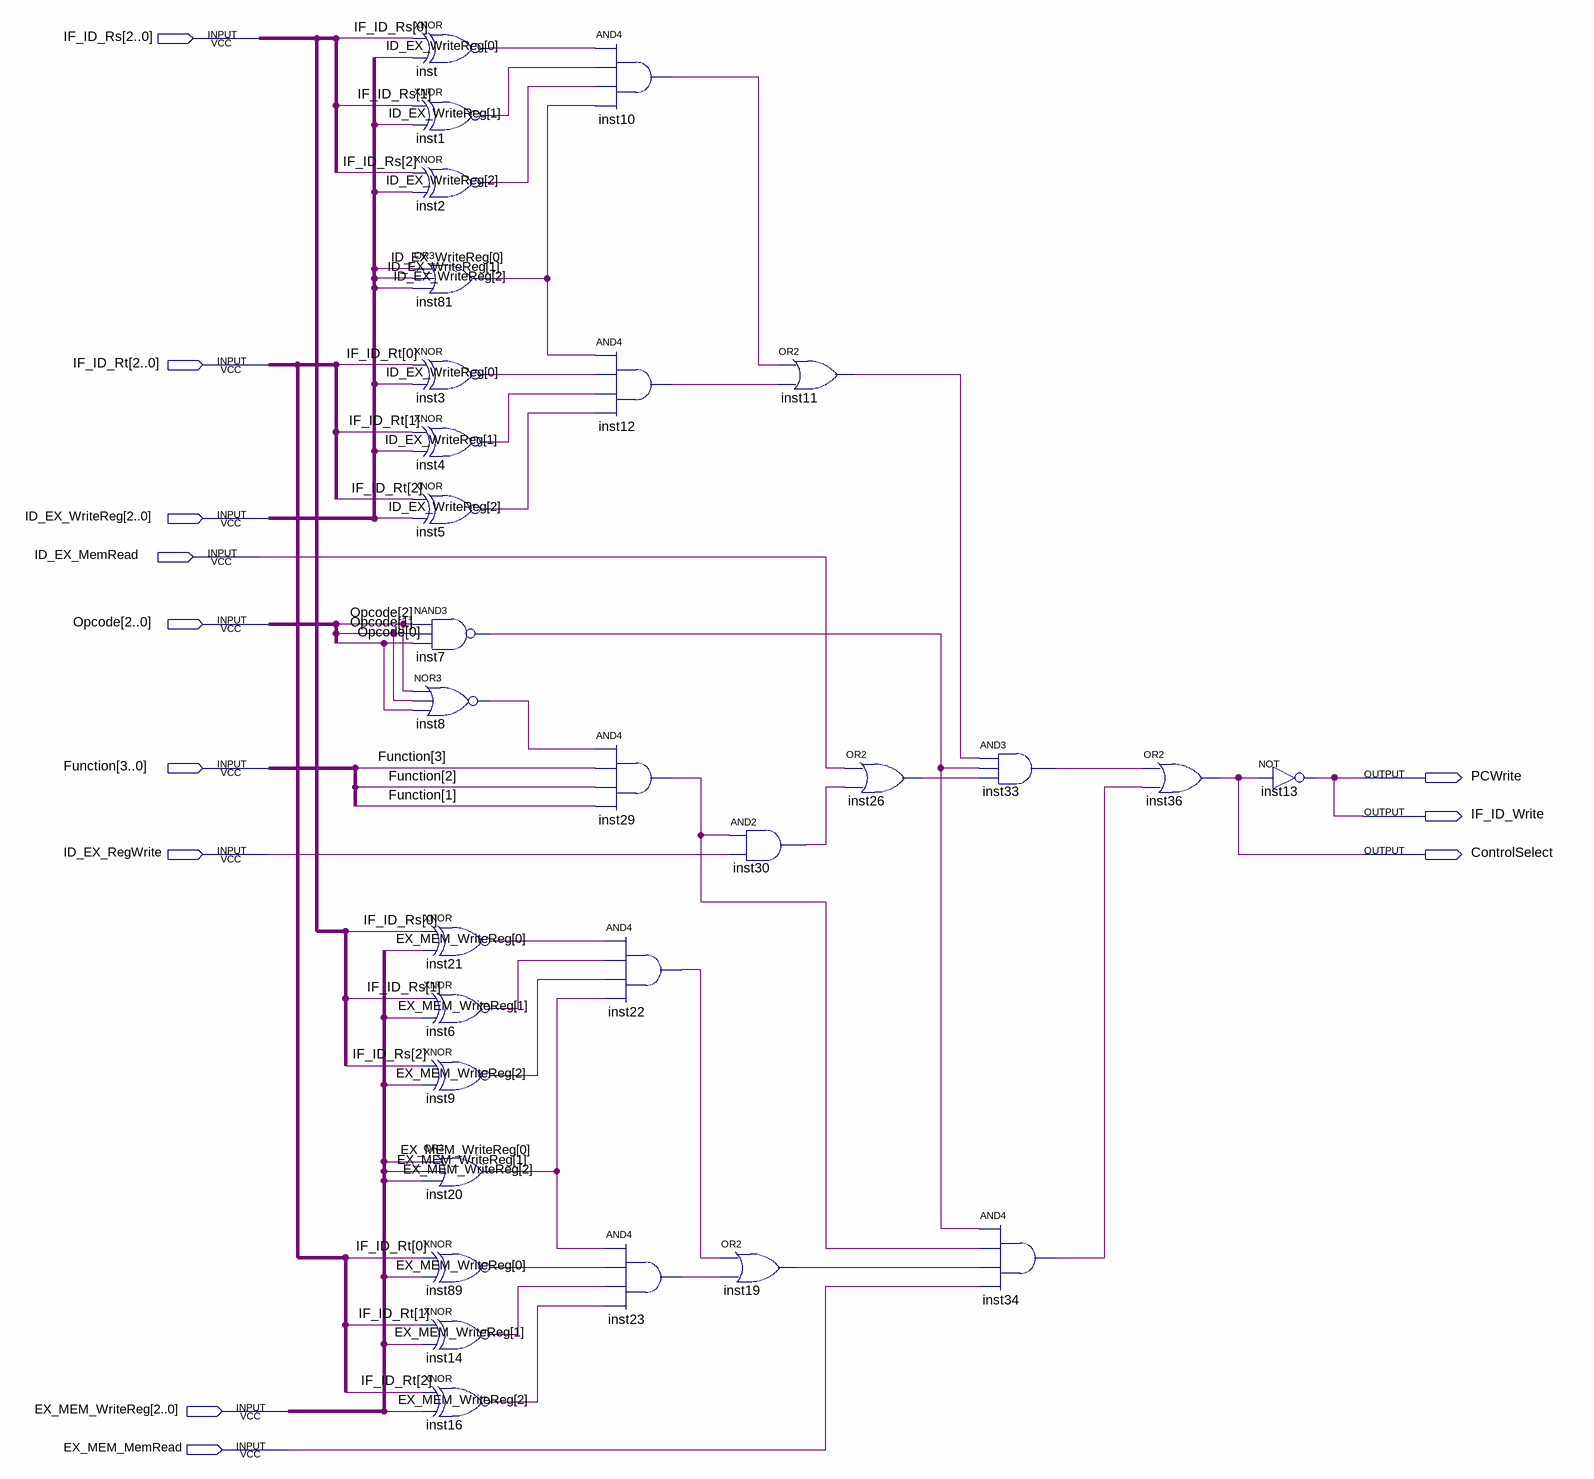
[diagram p0: schematic sheet]
// Quartus schematic HazardDetectionUnit.bdf as structural Verilog: 29 symbols, 12 pins
module HazardDetectionUnit (
  input  [2:0] IF_ID_Rs,
  input  [2:0] IF_ID_Rt,
  input  [2:0] ID_EX_WriteReg,
  input  ID_EX_MemRead,
  input  [2:0] Opcode,
  input  [3:0] Function,
  input  ID_EX_RegWrite,
  input  [2:0] EX_MEM_WriteReg,
  input  EX_MEM_MemRead,
  output PCWrite,
  output IF_ID_Write,
  output ControlSelect
);

  wire inst1_out, inst2_out, inst3_out, inst4_out, inst5_out, inst6_out, inst7_out, inst8_out, inst9_out,
       inst10_out, inst11_out, inst12_out, inst14_out, inst16_out, inst19_out, inst20_out, inst21_out,
       inst22_out, inst23_out, inst26_out, inst29_out, inst30_out, inst33_out, inst34_out, inst81_out,
       inst89_out, inst_out;

  xnor inst (inst_out, IF_ID_Rs[0], ID_EX_WriteReg[0]);
  xnor inst1 (inst1_out, IF_ID_Rs[1], ID_EX_WriteReg[1]);
  xnor inst2 (inst2_out, IF_ID_Rs[2], ID_EX_WriteReg[2]);
  or inst81 (inst81_out, ID_EX_WriteReg[0], ID_EX_WriteReg[1], ID_EX_WriteReg[2]);
  xnor inst3 (inst3_out, IF_ID_Rt[0], ID_EX_WriteReg[0]);
  xnor inst4 (inst4_out, IF_ID_Rt[1], ID_EX_WriteReg[1]);
  xnor inst5 (inst5_out, IF_ID_Rt[2], ID_EX_WriteReg[2]);
  nand inst7 (inst7_out, Opcode[2], Opcode[1], Opcode[0]);
  nor inst8 (inst8_out, Opcode[2], Opcode[1], Opcode[0]);
  xnor inst21 (inst21_out, IF_ID_Rs[0], EX_MEM_WriteReg[0]);
  xnor inst6 (inst6_out, IF_ID_Rs[1], EX_MEM_WriteReg[1]);
  xnor inst9 (inst9_out, IF_ID_Rs[2], EX_MEM_WriteReg[2]);
  or inst20 (inst20_out, EX_MEM_WriteReg[0], EX_MEM_WriteReg[1], EX_MEM_WriteReg[2]);
  xnor inst89 (inst89_out, IF_ID_Rt[0], EX_MEM_WriteReg[0]);
  xnor inst14 (inst14_out, IF_ID_Rt[1], EX_MEM_WriteReg[1]);
  xnor inst16 (inst16_out, IF_ID_Rt[2], EX_MEM_WriteReg[2]);
  and inst10 (inst10_out, inst_out, inst1_out, inst2_out, inst81_out);
  and inst12 (inst12_out, inst81_out, inst3_out, inst4_out, inst5_out);
  and inst29 (inst29_out, inst8_out, Function[3], Function[2], Function[1]);
  and inst22 (inst22_out, inst21_out, inst6_out, inst9_out, inst20_out);
  and inst23 (inst23_out, inst20_out, inst89_out, inst14_out, inst16_out);
  and inst30 (inst30_out, inst29_out, ID_EX_RegWrite);
  or inst19 (inst19_out, inst22_out, inst23_out);
  or inst11 (inst11_out, inst10_out, inst12_out);
  or inst26 (inst26_out, ID_EX_MemRead, inst30_out);
  and inst33 (inst33_out, inst11_out, inst7_out, inst26_out);
  and inst34 (inst34_out, inst7_out, inst29_out, inst19_out, EX_MEM_MemRead);
  or inst36 (ControlSelect, inst33_out, inst34_out);
  not inst13 (IF_ID_Write, ControlSelect);

  assign PCWrite = IF_ID_Write;
endmodule
